# EAGLE design TrinketBlinkM0G (EAGLE 8.4.3)
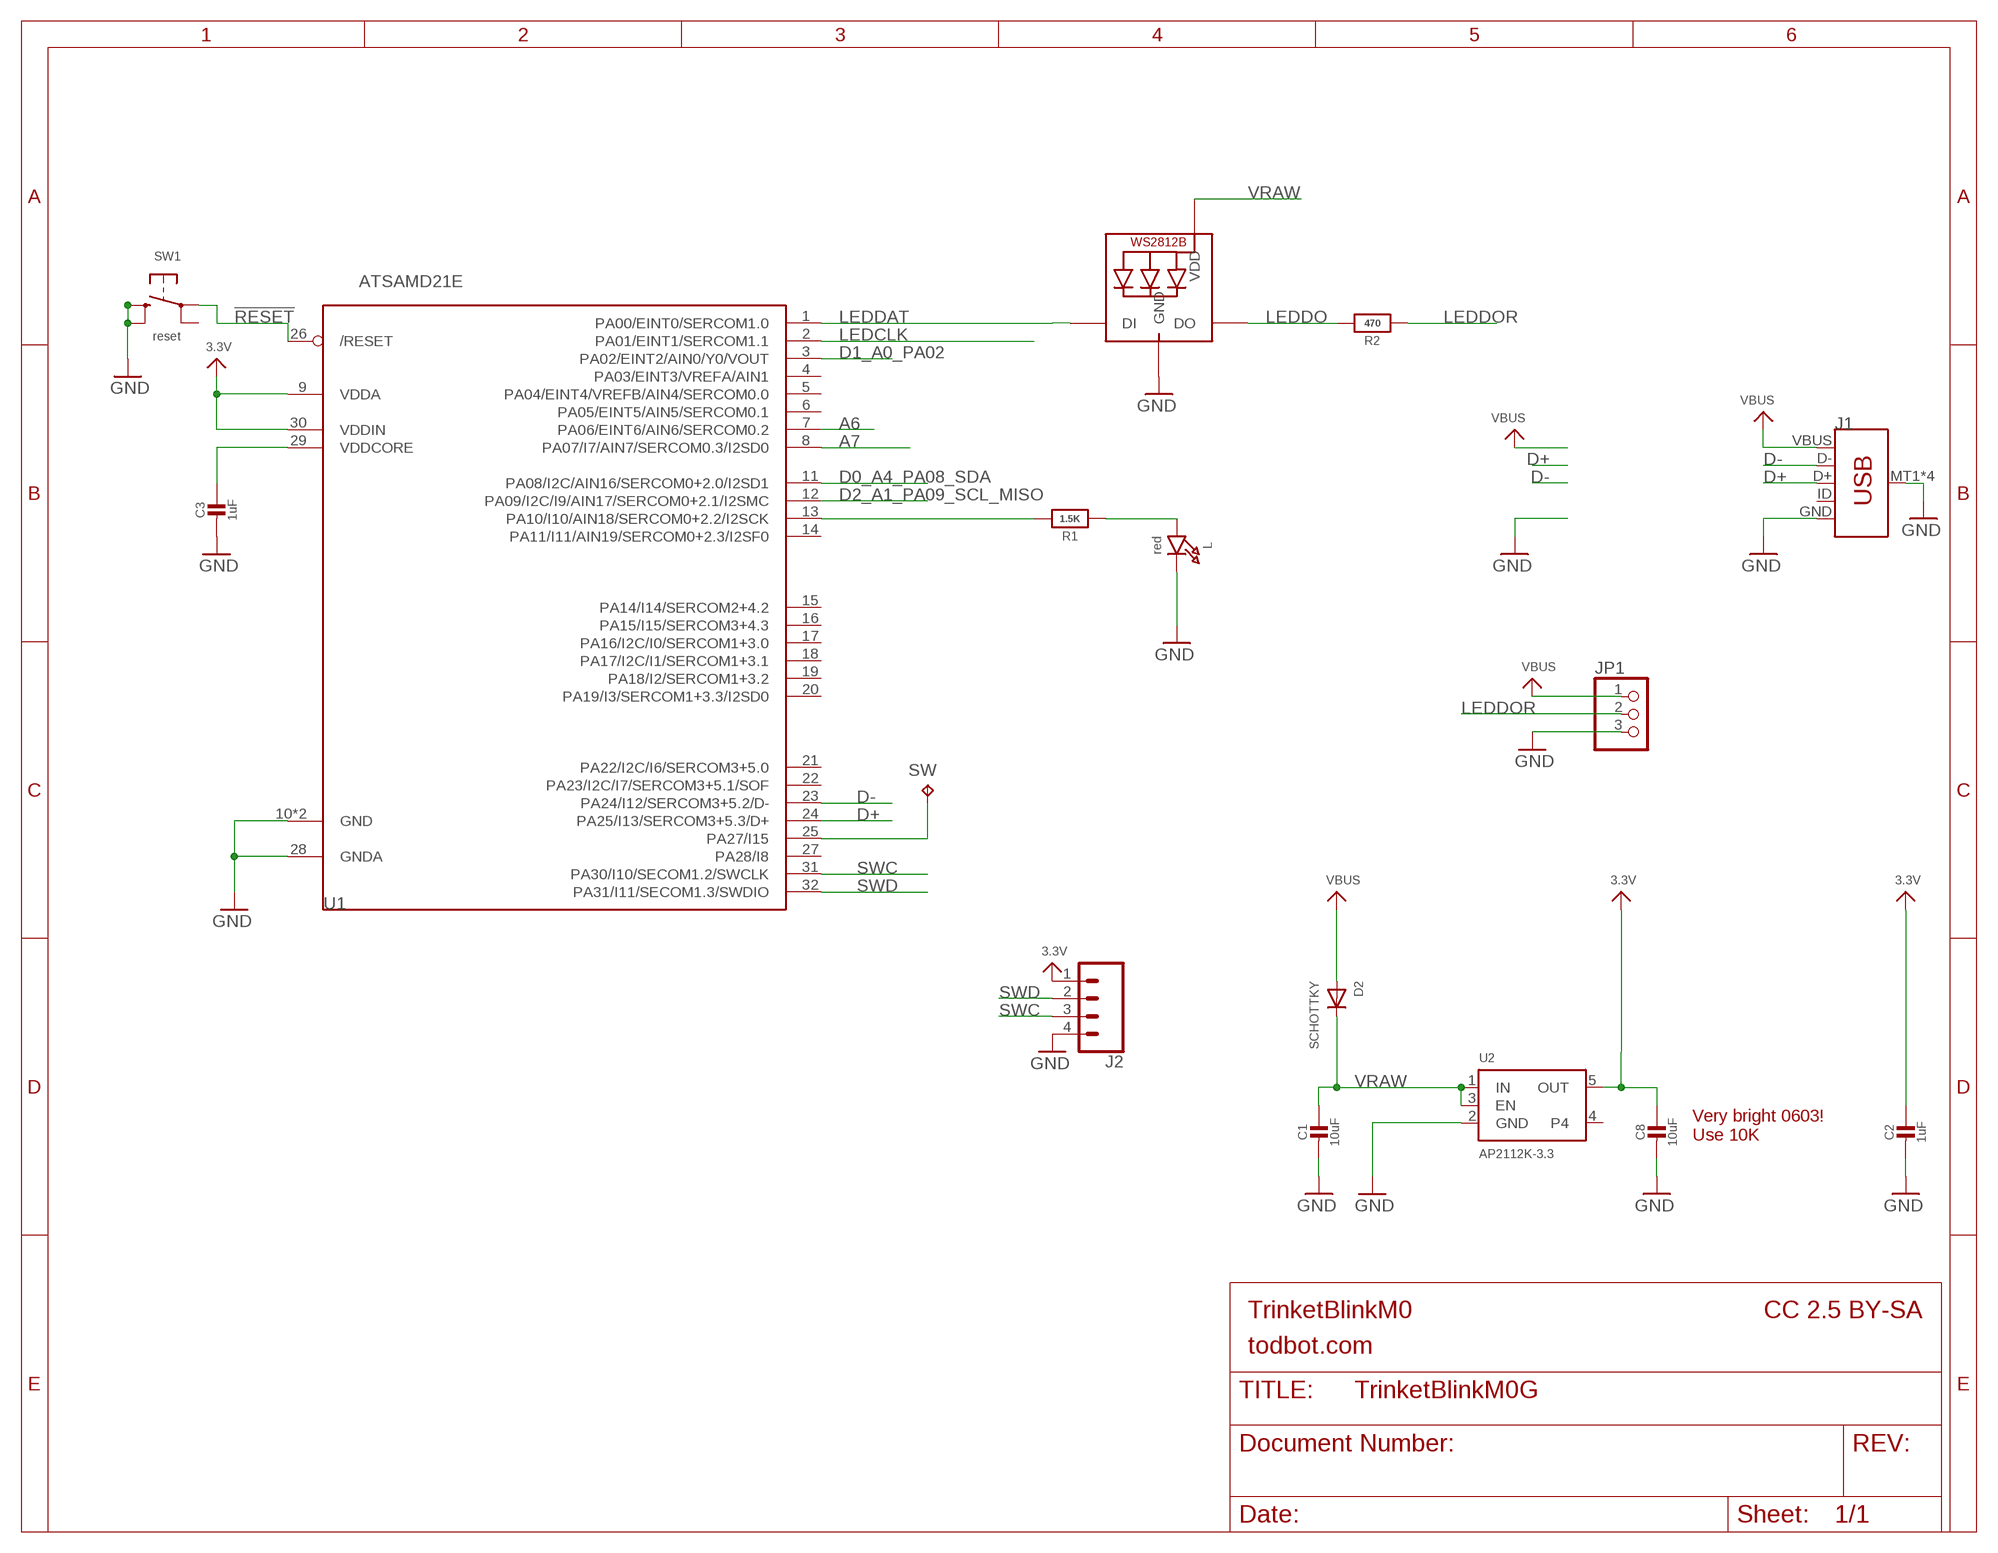
[diagram p0: schematic, sheet 1]

## Parts
C1  10uF  CAP_CERAMIC0805-NOOUTLINE  [0805-NO]
C2  1uF  CAP_CERAMIC0603_NO  [0603-NO]
C3  1uF  CAP_CERAMIC0603_NO  [0603-NO]
C8  10uF  CAP_CERAMIC0805-NOOUTLINE  [0805-NO]
D2  SCHOTTKY  DIODE_SOD-123FL  [SOD-123FL]
J1  USB_MICRO-B_SMT  [USB-MICROB]
J2  CONN_04  [1X04]
JP1  PINHD-1X3CB  [1X03-CLEANBIG]
L  red  LED0603_NOOUTLINE  [CHIPLED_0603_NOOUTLINE]
LED1  WS2812B_5050N  [WS2812B-NARROW]
R1  1.5K  RESISTOR_0603_NOOUT  [0603-NO]
R2  470  RESISTOR_0603_NOOUT  [0603-NO]
SW  TPB1,27  [B1,27]
SW1  reset  SWITCH_TACT_SMT4.6X2.8  [BTN_KMR2_4.6X2.8]
U1  ATSAMD21E  [QFN32_5MM]
U2  AP2112K-3.3  VREG_SOT23-5  [SOT23-5]

## Nets
3.3V: C2.1 C8.1 J2.1 U1.9(VDDA) U1.30(VDDIN) U2.5(OUT)
!RESET: SW1.A(P) U1.26(/RESET)
A6: U1.7(PA06/EINT6/AIN6/SERCOM0.2)
A7: U1.8(PA07/I7/AIN7/SERCOM0.3/I2SD0)
D0_A4_PA08_SDA: U1.11(PA08/I2C/AIN16/SERCOM0+2.0/I2SD1)
D1_A0_PA02: U1.3(PA02/EINT2/AIN0/Y0/VOUT)
D2_A1_PA09_SCL_MISO: U1.12(PA09/I2C/I9/AIN17/SERCOM0+2.1/I2SMC)
D+: J1.D+ U1.24(PA25/I13/SERCOM3+5.3/D+)
D-: J1.D- U1.23(PA24/I12/SERCOM3+5.2/D-)
GND: C1.2 C2.2 C3.2 C8.2 J1.GND J1.MT1(SHIELD) J1.MT2(SHIELD) J1.P$1(SHIELD) J1.P$2(SHIELD) J2.4 JP1.3 L.C LED1.3-GND(GND) SW1.B'(S1) SW1.B(S) U1.10(GND) U1.28(GNDA) U1.33(GND) U2.2(GND)
LEDCLK: U1.2(PA01/EINT1/SERCOM1.1)
LEDDAT: LED1.4-DIN(DI) U1.1(PA00/EINT0/SERCOM1.0)
LEDDO: LED1.2-DOUT(DO) R2.2
LEDDOR: JP1.2 R2.1
N$1: L.A R1.1
N$2: R1.2 U1.13(PA10/I10/AIN18/SERCOM0+2.2/I2SCK)
SW: SW.TP U1.25(PA27/I15)
SWC: J2.3 U1.31(PA30/I10/SECOM1.2/SWCLK)
SWD: J2.2 U1.32(PA31/I11/SECOM1.3/SWDIO)
VBUS: D2.A J1.VBUS JP1.1
VDDCORE: C3.1 U1.29(VDDCORE)
VRAW: C1.1 D2.C LED1.1-VDD(VDD) U2.1(IN) U2.3(EN)
Unconnected: J1.ID SW1.A'(P1) U1.4(PA03/EINT3/VREFA/AIN1) U1.5(PA04/EINT4/VREFB/AIN4/SERCOM0.0) U1.6(PA05/EINT5/AIN5/SERCOM0.1) U1.14(PA11/I11/AIN19/SERCOM0+2.3/I2SF0) U1.15(PA14/I14/SERCOM2+4.2) U1.16(PA15/I15/SERCOM3+4.3) U1.17(PA16/I2C/I0/SERCOM1+3.0) U1.18(PA17/I2C/I1/SERCOM1+3.1) U1.19(PA18/I2/SERCOM1+3.2) U1.20(PA19/I3/SERCOM1+3.3/I2SD0) U1.21(PA22/I2C/I6/SERCOM3+5.0) U1.22(PA23/I2C/I7/SERCOM3+5.1/SOF) U1.27(PA28/I8) U2.4

## Notes on the sheet
- Very bright 0603!
  Use 10K
- TrinketBlinkM0 | CC 2.5 BY-SA
- todbot.com

## Library data of the parts
C1-C3 C8 = microbuilder:CAP_CERAMIC: Ceramic Capacitors For new designs, use the packages preceded by an '_' character since they are more reliable: The following footprints should be used on most boards: _0402 - Standard footprint for regular board layouts _0603 - Standard footprint for regular board layouts _0805 - Standard footprint for regular board layouts _1206 - Standard footprint for regular board layouts For extremely tight-pitch boards where space is at a premium, the following 'micro-pitch' footprints can be used (smaller pads, no silkscreen outline, etc.): _0402MP - Micro-pitch footprint for very dense/compact boards _0603MP - Micro-pitch footprint for very dense/compact boards _0805MP - Micro-pitch footprint for very dense/compact boards _1206MP - Micro-pitch footprint for very dense/compact boards
D2 = adafruit:DIODE: Diode SMADIODE - SMA Surface Mount Package 20V 1A Schottky Diode Digikey: 641-1014-6-ND DO-1N4148 - Through Hole Small Current Diode SOD-123 20V 1 A (.5mV Vf) Schottky Diode - Digikey: MBRX120TPMSCT-ND SOD-323 10V 570mA (.38mV Vf, 3ns) Schottky Diode - Digikey: ZLLS410CT-ND SOD-523 30V 30mA Schottky Diode (RB751S-40TE61) - Digikey: RB751S-40TE61CT-ND SOT23-R/W - SOT23 Package (R = Solder Paste/Reflow Ovens, W = Hand-Soldering) BAT54Film 40V 300mA - Digikey: 497-7162-1-ND
J1 = SparkFun-Connectors:USB_MICRO-B: USB Type Micro-B Connector Male/female and PTH/SMT variants SparkFun Products: SparkFun microB USB Breakout <https://www.sparkfun.com/products/12035> SparkFun USB microB Plug Breakout <https://www.sparkfun.com/products/10031> SparkFun ESP8266 Thing <https://www.sparkfun.com/products/13231>; PROD_ID: CONN-09505; SF_ID: PRT-08533
J2 = SparkFun-Connectors:CONN_04: Multi connection point. Often used as Generic Header-pin footprint for 0.1 inch spaced/style header connections On any of the 0.1 inch spaced packages, you can populate with these: Break Away Headers - Straight <https://www.sparkfun.com/products/116> (PRT-00116) Break Away Male Headers - Right Angle <https://www.sparkfun.com/products/553> (PRT-00553) Female Headers <https://www.sparkfun.com/products/115> (PRT-00115) Break Away Headers - Machine Pin <https://www.sparkfun.com/products/117> (PRT-00117) Break Away Female Headers - Swiss Machine Pin <https://www.sparkfun.com/products/743> (PRT-00743) For SCREWTERMINALS and SPRING TERMINALS visit here: Screw Terimnals on SparkFun.com <https://www.sparkfun.com/search/results?term=Screw+Terminals> (5mm/3.5mm/2.54mm spacing) This device is also useful as a general connection point to wire up your design to another part of your project. Our various solder wires solder well into these plated through hole pads. Hook-Up Wire - Assortment (Stranded, 22 AWG) <https://www.sparkfun.com/products/11375> (PRT-11375) Hook-Up Wire - Assortment (Solid Core, 22 AWG) <https://www.sparkfun.com/products/11367> (PRT-11367) View the entire wire category on our website here <https://www.sparkfun.com/categories/141> Special notes: Molex polarized connector foot print use with SKU : PRT-08231 with associated crimp pins and housings. 1MM SMD Version SKU: PRT-10208; PROD_ID: CONN-09696
JP1 = adafruit:PINHD-1X3: PIN HEADER
L = microbuilder:LED: LED 0603 - 0603 Surface Mount Package 2mA: Green LED - Low Power (3.9mcd, 2ma, 1.7Vf) - Digikey: 475-2709-2-ND Orange LED - Low Power (9.8mcd, 2ma, 1.8Vf) - Digikey: 475-1194-2-ND Red LED - Low Power (5mcd, 2ma, 1.8Vf) - Digikey: 475-1195-2-ND Yellow LED - Low Power (7mcd, 2ma, 1.8Vf) - Digikey: 475-1196-2-ND 5mA: Blue LED - Low Power (17mcd, 5ma, 2.9Vf) - Digikey: LNJ937W8CRACT-ND 0805 - 0805 Surface Mount Package 2mA: Red LED (8.8mcd, 2mA, 1.8Vf, Clear) - Low Power [Digikey: 475-2510-1-ND] Green LED (5mcd, 2mA, 1.8Vf, Clear) - Low Power [Digikey: 475-2730-1-ND] Yellow LED (11.3mcd, 2mA, 1.8Vf, Clear) - Low Power [Digikey: 475-2555-1-ND] 20mA: Red LED (104mcd, 20mA, Diffused) - LS R976 [Digikey: 475-1278-6-ND] Red LED (12mcd, 20mA, 2.0Vf, Clear) - APT2012EC [Digikey: 754-1128-1-ND] Green LED (15mcd, 20mA, 2.2Vf, Clear) - APT2012GC [Digikey: 754-1131-1-ND] Orange LED (160mcd, 20mA, 2.1Vf, Clear) - APT2012SECK [Digikey: 754-1130-1-ND] 1206 - 1206 Surface Mount Package Green LED (26mcd, 20mA, Diffused) - LG N971 [Digikey: 475-1407-6-ND] Red LED (15mcd, 20mA, Diffused) - LH N974 [Digikey: 475-1416-6-ND] Cree - Cree High-Power Surface Mount LEDs XPEBWT-L1-0000-00D50 - White 111lm 350mA 2.9Vf 6200K 110° XTEAWT-00-0000-00000LEE3 - White 114lm 350mA 2.85Vf 5000K 115° Everlight - Everlight 45-21 Series Surface Mount LEDs 45-21/QK2C-B2832AC2CB2/2T - Warm White 2000mcd 20mA 3.25Vf 3050K 120° 45-21/LK2C-B38452C4CB2/2T - Nuetral White 2000mcd 20mA 3.25Vf 4150K 120° 45-21/LK2C-B50634C6CB2/2T - Cold White 2200mcd 20mA 3.25Vf 5650K 120° PLCC2 Reverse Mount LS T77K-J1L2-1-0-2-R18-Z - Red 11.25mcd 2mA 1.8Vf 630nm 120° LO T77K-L1M2-24-Z - Orange 19.6mcd 2mA 1.8Vf 606nm 120° LY T77K-K2M1-26-Z - Yellow 15.7mcd 2mA 1.8Vf 587nm 120°
LED1 = adafruit:WS2812B
R1 R2 = microbuilder:RESISTOR: Resistors For new designs, use the packages preceded by an '_' character since they are more reliable: The following footprints should be used on most boards: _0402 - Standard footprint for regular board layouts _0603 - Standard footprint for regular board layouts _0805 - Standard footprint for regular board layouts _1206 - Standard footprint for regular board layouts For extremely tight-pitch boards where space is at a premium, the following 'micro-pitch' footprints can be used (smaller pads, no silkscreen outline, etc.): _0402MP - Micro-pitch footprint for very dense/compact boards _0603MP - Micro-pitch footprint for very dense/compact boards _0805MP - Micro-pitch footprint for very dense/compact boards _1206MP - Micro-pitch footprint for very dense/compact boards
SW = testpad:TP: Test pad
SW1 = microbuilder:SWITCH_TACT_SMT: SMT Tact Switches 6x6mm - Digikey: P12940SCT-ND KMR2 (4.6x2.8mm) - Digikey: 401-1426-1-ND EVQ-PQHB55 - Light Touch, 160GF (4.5x4.5mm) - Digikey: P8090SCT-ND KMT0 - KMT021 NGJ LHS (etc.) IP68/Waterproof - Digikey: CKN10289CT-ND
U1 = microbuilder:ATSAMD21E
U2 = microbuilder:VREG_SOT23-5: SOT23-5 Fixed Voltage Regulators Part Current Out V Out V In V Dropout θJA (°C/W) TJ (°C) Digikey Part No. ADP121 150mA 3.3V 3.4-5.5V 0.09V @ 150mA -- -- ADP121-AUJZ33R7CT-ND ADP121 150mA 3.0V 3.1-5.5V 0.09V @ 150mA -- -- ADP121-AUJZ30R7CT-ND ADP122 300mA 3.3V 3.4-5.5V 0.085V @ 300mA -- -- ADP122AUJZ-3.3-R7CT-ND ADP1712 300mA 3.3V 3.5-5.5V 0.17V @ 300mA -- -- ADP1712AUJZ-3.3-R7TR-ND AP7311 (Low Cost) 150mA 3.3V 3.5-6V 0.15V @ 150mA -- -- AP7311-33WG-7DICT-ND LD39015M18R 150mA 1.8V 1.9V-5.5V 0.08V @ 100mA -- -- 497-6977-1-ND LP2985A-33DBVR 150mA 3.3V 3.3-16V 0.28V @ 150mA 206 150 296-18479-1-ND MCP1824T-3302E/OT 300mA 3.3V 3.5V-6V 0.2V @ 300mA -- -- MCP1824T-3302E/OTCT-ND MIC5205-2.5YM5 TR 150mA 2.5V 2.7-16V 0.165V @ 150mA -- -- 576-1257-2-ND MIC5205-3.0YM5 TR 150mA 3.0V 3.2V-16V 0.165V @ 150mA -- -- 576-1258-2-ND MIC5205-3.3YM5 TR 150mA 3.3V 3.5V-16V 0.165V @ 150mA -- -- 576-1259-2-ND TPS780330220 150mA 3.3V+2.2V 3.6-5.5V 250mV Max -- -- 296-23332-1-ND TDA3663/N1,135 100mA 3.3V 3.5-45V 0.18V @ 50mA -- -- 568-5343-1-ND Max operating temp can be calculated using θJA, TJ (max junction temperature), and power in watts. Set the "Maximum Ambient Temperature" until it reaches TJ ("Max Junction Temperature"), which is the absolute limit for safe use of the regulator: Heat Sink Temperature Calculator <http://www.daycounter.com/Calculators/Heat-Sink-Temperature-Calculator.phtml> For example, With 12V source into a 3.3V LP2985 and a 30mA load, we are dissipating (12V-3.3V) * 0.03A = 0.261W. With a θJA of 206 °C/W, a TJ of 150°C, and 261mW we can safely use the chip without a heat sink up to 75°C (=147.1°C Junction Temperature).

## Net classes
1 power: width 0.305 mm

## Board
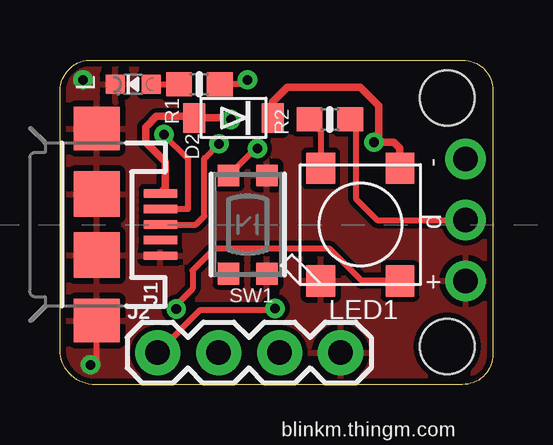
[diagram p1: board, top side]
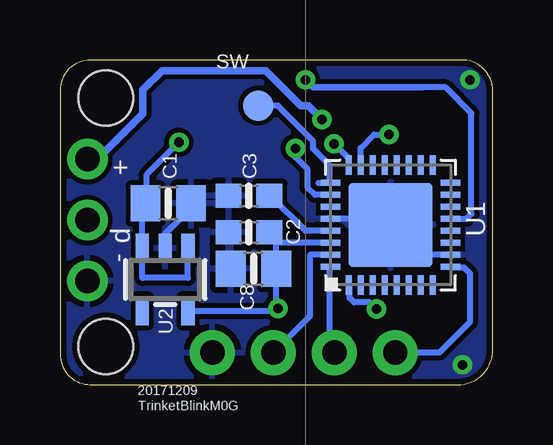
[diagram p2: board, bottom side, seen from below]

Size 18.04 x 13.53 mm. Coordinates in mm from the lower left corner, seen from the top.
Outline: 1.21,13.53 15.69,13.53 16.77,13.53 arc-90 18.04,12.26 18.04,1.27 arc-90 16.77,0 16.33,0 1.34,0 arc-90 0.01,1.59 0.01,3.87 0.01,4.32 0.01,9.14 0.01,9.46 0.01,12.13 arc-90 1.21,13.53
Copper layers (1*16): Top 0.035mm / dielectric 1.5mm / Bottom 0.035mm
Design rules "adafruit *": minimum track width 8mil, minimum drill 15.5mil, track to track 8mil, track to pad 8mil, pad to pad 8mil, via to via 8mil, smd to smd 8mil, copper to edge 10mil, drill to drill 8mil, minimum pad ring 10mil, minimum via ring 8mil, stop-mask expansion 2mil, vias tented up to drill 20mil, thermal gap 10mil
Holes 2.29 mm at 16.13,1.59 16.13,11.94

### Footprints (pad centres in the part's own frame; a part is rotated, then mirrored left to right if it is on the bottom)
0805-NO = smd 1.24 x 1.5: 1 -0.95,0; 2 0.95,0
0603-NO = smd 1.075 x 1: 1 -0.85,0; 2 0.85,0
SOD-123FL = smd 0.91 x 1.22: A 1.637,0; C -1.637,0
USB-MICROB = smd 1.4 x 0.35: D+ -2.65,0; D- -2.65,-0.65; GND -2.65,1.3; ID -2.65,0.65; VBUS -2.65,-1.3 | smd 1.9 x 1.8: MT1 0,-4; MT2 0,4 | smd 1.9 x 1.9: P$1 0,-1.27; P$2 0,1.27
1X04 = drill 1.016 pad 1.88: 1 0,0; 2 2.54,0; 3 5.08,0; 4 7.62,0
1X03-CLEANBIG = drill 1.016 pad 1.676: 1 -2.54,0; 2 0,0; 3 2.54,0
CHIPLED_0603_NOOUTLINE = smd 0.8 x 0.8: A 0,-0.75; C 0,0.75
WS2812B-NARROW = smd 1.3 x 1.2: 1-VDD 2.35,-1.65; 2-DOUT 2.35,1.65; 3-GND -2.35,1.65; 4-DIN -2.35,-1.65
B1,27 = smd 1.27 x 1.27: TP 0,0
BTN_KMR2_4.6X2.8 = smd 0.9 x 0.9: A 2.05,0.8; A' -2.05,0.8; B 2.05,-0.8; B' -2.05,-0.8
QFN32_5MM = smd 0.8 x 0.25: 1 -2.5,1.75; 2 -2.5,1.25; 3 -2.5,0.75; 4 -2.5,0.25; 5 -2.5,-0.25; 6 -2.5,-0.75; 7 -2.5,-1.25; 8 -2.5,-1.75; 17 2.5,-1.75; 18 2.5,-1.25; 19 2.5,-0.75; 20 2.5,-0.25; 21 2.5,0.25; 22 2.5,0.75; 23 2.5,1.25; 24 2.5,1.75 | smd 0.25 x 0.8: 9 -1.75,-2.5; 10 -1.25,-2.5; 11 -0.75,-2.5; 12 -0.25,-2.5; 13 0.25,-2.5; 14 0.75,-2.5; 15 1.25,-2.5; 16 1.75,-2.5; 25 1.75,2.5; 26 1.25,2.5; 27 0.75,2.5; 28 0.25,2.5; 29 -0.25,2.5; 30 -0.75,2.5; 31 -1.25,2.5; 32 -1.75,2.5 | smd 3.5 x 3.5: 33 0,0
SOT23-5 = smd 0.55 x 1.2: 1 -0.95,-1.3; 2 0,-1.3; 3 0.95,-1.3; 4 0.95,1.3; 5 -0.95,1.3

### Placement (x,y rotation side)
C1  13.53,7.56 0 bottom
C2  10.17,6.35 180 bottom
C3  10.17,7.87 180 bottom
C8  9.97,4.83 180 bottom
D2  7.23,11.11 180 top
J1  1.53,6.67 180 top
J2  4.07,1.33 0 top
JP1  16.9,6.86 270 top
L  3.05,12.51 90 top
LED1  12.51,6.67 90 top
R1  5.81,12.51 0 top
R2  11.24,11.05 180 top
SW  9.78,11.62 180 bottom
SW1  7.82,6.67 90 top
U1  4.27,6.65 90 bottom
U2  13.66,4.38 180 bottom
U$1  [TRINKET_M0_BOTTOM]  18.99,14.29 270 bottom
U$20  [TRINKET_M0_TOP]  18.99,-0.95 90 top

### Tracks (layer width: path | path; a pad name or v marks a point on that pad's centre or on a via)
3.3V  (via drill 0.4)
  Top 0.254: J2.1 5.85,3.11 8.96,3.11 v8.96,3.17
  Bottom 0.254: U1.9 1.21,4.89 0.96,4.64 0.96,2.6 2.23,1.33 J2.1 | C2.1 9.28,6.35 9.03,6.35 | 9.03,6.35 9.03,5.9 | 9.03,5.9 C8.1 9.03,3.17 | U1.30 9.03,5.9 | 9.03,5.9 9.03,6.35 | 9.03,3.17 v8.96,3.17 | U2.5 9.03,3.08 9.03,3.17
!RESET  (via drill 0.4)
  Top 0.254: SW1.A 8.15,9.84 v8.23,9.84
  Bottom 0.254: 8.23,9.46 8.23,9.48 | 8.23,9.48 8.23,9.61 | 8.23,9.46 8.23,9.48 | 8.23,9.48 8.23,9.61 | 8.23,9.61 v8.23,9.84 | 8.23,9.48 7.72,8.97 7.72,8.21 7.41,7.9 U1.26 | 8.23,9.48 8.23,9.46
D+  (via drill 0.4)
  Top 0.254: J1.D+ 5.66,6.67 6.01,7.02 6.01,9.44 6.02,9.44 v6.62,10.03
  Bottom 0.254: 6.02,9.46 U1.24 6.02,9.43 v6.62,10.03
D-  (via drill 0.4)
  Top 0.254: J1.D- 5.34,7.32 5.34,9.41 v4.33,10.41
  Bottom 0.254: v4.33,10.41 4.96,10.41 5.52,9.86 U1.23
GND  (via drill 0.4)
  Top 0.254: v1.28,0.83 1.53,0.83 J1.MT2
  Bottom 0.254: U1.28 4.52,6.9 U1.33 4.39,6.53 4.39,5.4 4.38,5.4 U1.10 | U2.2 13.66,6.29 12.58,7.36 C1.2
  other vias: 0.96,12.7
  pour Bottom: 0.01,-0.95 18.99,-0.95 18.99,14.29 0.01,14.29
  pour Top: -0.19,-1.4 18.8,-1.4 18.93,15.11 -0.06,15.11
LEDDAT  (via drill 0.4)
  Top 0.254: LED1.4-DIN 12.58,4.32 11.25,5.65 6.42,5.65 5.53,4.76 5.53,4 4.84,3.31 v4.84,3.15
  Bottom 0.254: v4.84,3.15 5.12,3.42 5.78,3.42 5.97,3.62 5.97,4.11 U1.1
LEDDO
  Top 0.254: R2.2 10.87,10.58 LED1.2-DOUT
LEDDOR
  Top 0.254: 12.32,11.01 12.32,10.16 | R2.1 12.32,11.05 12.32,10.16 | 12.32,10.16 12.32,7.75 13.21,6.86 JP1.2 | JP1.2 17.28,6.86 17.4,6.99 17.02,6.99 JP1.2
N$1
  Top 0.254: L.A R1.1
N$2  (via drill 0.4)
  Top 0.254: v7.82,12.7 7.63,12.51 R1.2
  Bottom 0.254: U1.13 1.1,6.9 0.89,7.11 0.89,11.3 1.97,12.38 2.93,12.38 | 7.5,12.38 2.93,12.38 | 7.5,12.38 v7.82,12.7 | 2.93,12.38 7.5,12.38
SW
  Bottom 0.254: 7.26,8.4 U1.25 6.8,8.44 6.8,9.14 7.49,9.84 7.49,10.15 8.97,11.62 SW.TP
SWC
  Bottom 0.254: U1.31 7.63,5.4 7.63,2.86 J2.3
SWD
  Bottom 0.254: J2.2 6.8,1.52 6.8,4.9 U1.32
VBUS  (via drill 0.4)
  Top 0.254: 4.2,7.98 J1.VBUS
  Top 0.305: J1.VBUS 4.39,8.18 4.39,9.29 3.57,10.1 3.57,10.73 4.02,11.17 4.7,11.17 4.7,11.18 5.53,11.18 D2.A 7.05,11.11 v7.12,11.05
  Bottom 0.305: v7.12,11.05 7.69,11.62 8,11.62 9.46,13.08 13.79,13.08 14.59,12.28 14.59,11.3 16.26,9.62 16.26,9.34 16.33,9.4 JP1.1
VDDCORE
  Bottom 0.254: U1.29 7.8,6.4 9.28,7.87 C3.1
VRAW  (via drill 0.4)
  Top 0.254: 9.02,11.27 D2.C
  Top 0.305: D2.C 8.87,11.79 9.47,12.38 12.51,12.38 13.28,11.62 13.28,10.29 v13.09,10.1 13.91,10.1 14.17,9.84 LED1.1-VDD
  Bottom 0.254: U2.1 12.71,4.45 14.61,4.45 U2.3 14.61,7.56 C1.1 | C1.1 14.17,7.56 | C1.1 14.42,7.62 14.42,8.76 13.59,9.59 v13.09,10.1

### Text on the board
tPlace: BlinkM M0 | - | d | + | blinkm.thingm.com
bPlace: + | d | - | 20171209 | TrinketBlinkM0G